# Altium schematic sheet Supply_Protection.SchDoc
size A4; SheetNumber: 3; SheetTotal: 18
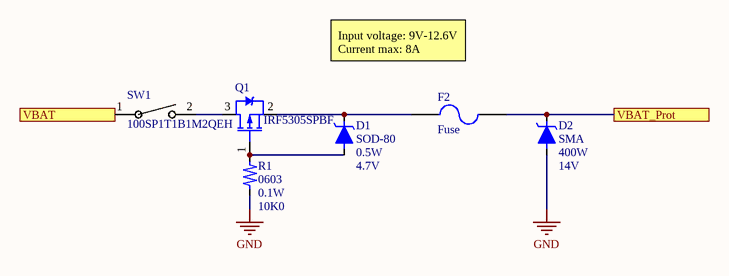
[diagram p0: Supply_Protection.SchDoc]

## Parts
D1  SOD-80  value 4.7V  Rating: 0.5W  [SOD-80]
D2  SMA  value 14V  Rating: 400W  [SMA]
F2  Fuse  [F_2410]
Q1  IRF5305SPBF  [D2PAK-2]
R1  0603  value 10K0  Rating: 0.1W  [R_0603]
SW1  100SP1T1B1M2QEH  [SW_100SP1T_12P7X6P86_EWI]

## Ports
VBAT (in), VBAT_Prot

## Nets
GND: D2.2(DA) R1.1(R1)
VBAT: SW1.1 ; port VBAT
VBAT_Prot: D2.1(DC) F2.2 ; port VBAT_Prot
NetD1_1: D1.1(DC) F2.1 Q1.2(S)
NetD1_2: D1.2(DA) Q1.1(G) R1.2(R2)
NetQ1_3: Q1.3(D) SW1.2

## Notes on the sheet
- Input voltage: 9V-12.6V
  Current max: 8A

## Library data of the parts
D1 = TZMC4V7GS08: Type: Zener Diode; ID: Dio_SOD-80_4.7V_0.5W_Zener; Distributor: Lomex; Link: http://lomex.hu/hu/webshop/#/page,0/search,85-00-95/stype,1/sidx,1; Order Number: 85-00-95; Package: SOD-80; Part Number: TZMC4V7GS08; Price (HUF): 5; NI part number: -; NI PEN/DEB: -
D2 = SMAJ12A: Type: Transient Voltage Suppressor; ID: Dio_SMA_14V_400W_Transient_Sup; Distributor: Lomex; Link: http://lomex.hu/hu/webshop/#/page,0/search,96-00-77/stype,1/sidx,1; Order Number: 96-00-77; Package: SMA; Part Number: SMAJ12A; Price (HUF): 17; NI part number: -; NI PEN/DEB: -
F2 = 0451003.MRL: ID: Oth_0451003.MRL_F_2410; Rating: 125V; Type: Very Fast Acting Fuse; Value: 3A; Distributor: Lomex; Link: http://lomex.hu/hu/webshop/#page,0/search,44-02-68/stype,1; Order number: 44-02-68; Package: F_2410; Part Number: 0451003.MRL; Price (HUF): 33; NI part number: -; NI PEN/DEB: -
Q1 = IRF5305SPBF: P-Channel Power MOSFET; ID: Tra_D2PAK-2_55V_31A_P-FET; Rating: 31A; Type: P-FET; Value: 55V; Distributor: Lomex; Link: http://lomex.hu/hu/webshop/#/page,0/stype,1/sidx,10/instock,0/search,86-02-47; Order number: 86-02-47; Package: D2PAK-2; Part Number: IRF5305SPBF; Price (HUF): 230; NI part number: -; NI PEN/DEB: -
R1 = CR-03FL7---10K: NI part number: 713771-01; Tolerance: 1%; ID: Res_0603_10K0_0.1W_Chip; NI PEN/DEB: DEB; Type: Chip Resistor; Part Number: CR-03FL7---10K; Order Number: 80-11-68; Distributor: Lomex; Link: http://lomex.hu/hu/webshop/#/page,0/search,80-11-68/stype,1/sidx,1; Price (HUF): 0.80; Package: 0603
SW1 = 100SP1T1B1M2QEH: No Description Available; Mfr_Name: E-Switch; Copyright: Copyright (C) 2023 Ultra Librarian. All rights reserved.; Manufacturer_Part_Number: 100SP1T1B1M2QEH